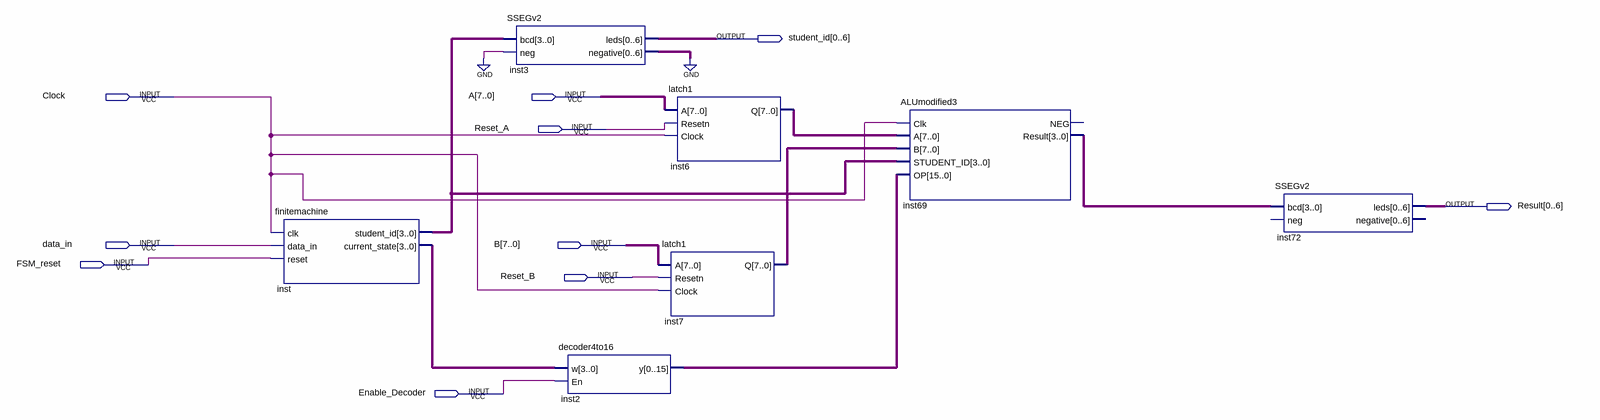
[diagram p0: schematic sheet]
// Quartus schematic Lab6problem3.bdf as structural Verilog: 7 symbols, 10 pins
module Lab6problem3 (
  input  Clock,
  input  [7:0] A,
  input  Reset_A,
  input  data_in,
  input  [7:0] B,
  input  FSM_reset,
  input  Reset_B,
  input  Enable_Decoder,
  output [0:6] student_id,
  output [0:6] Result
);

  wire [3:0] inst69_result, inst_current_state, inst_student_id;
  wire [6:0] inst3_negative;
  wire [7:0] inst6_q, inst7_q;
  wire [15:0] inst2_y;

  finitemachine inst (
    .clk(Clock), .data_in(data_in), .reset(FSM_reset), .student_id(inst_student_id),
    .current_state(inst_current_state));
  SSEGv2 inst3 (.bcd(inst_student_id), .neg(1'b0), .leds(student_id), .negative(inst3_negative));
  decoder4to16 inst2 (.w(inst_current_state), .En(Enable_Decoder), .y(inst2_y));
  latch1 inst6 (.A(A), .Resetn(Reset_A), .Clock(Clock), .Q(inst6_q));
  latch1 inst7 (.A(B), .Resetn(Reset_B), .Clock(Clock), .Q(inst7_q));
  ALUmodified3 inst69 (
    .Clk(Clock), .A(inst6_q), .B(inst7_q), .STUDENT_ID(inst_student_id), .OP(inst2_y), .Result(inst69_result));  // open: NEG
  SSEGv2 inst72 (.bcd(inst69_result), .leds(Result));  // open: neg, negative
  // also tied to GND on the sheet: {inst3_negative[0], inst3_negative[1], inst3_negative[2], inst3_negative[3], inst3_negative[4], inst3_negative[5], inst3_negative[6]}
endmodule
